# EAGLE design hackvision_v1.0 (EAGLE 5.06)
REV: 1.0
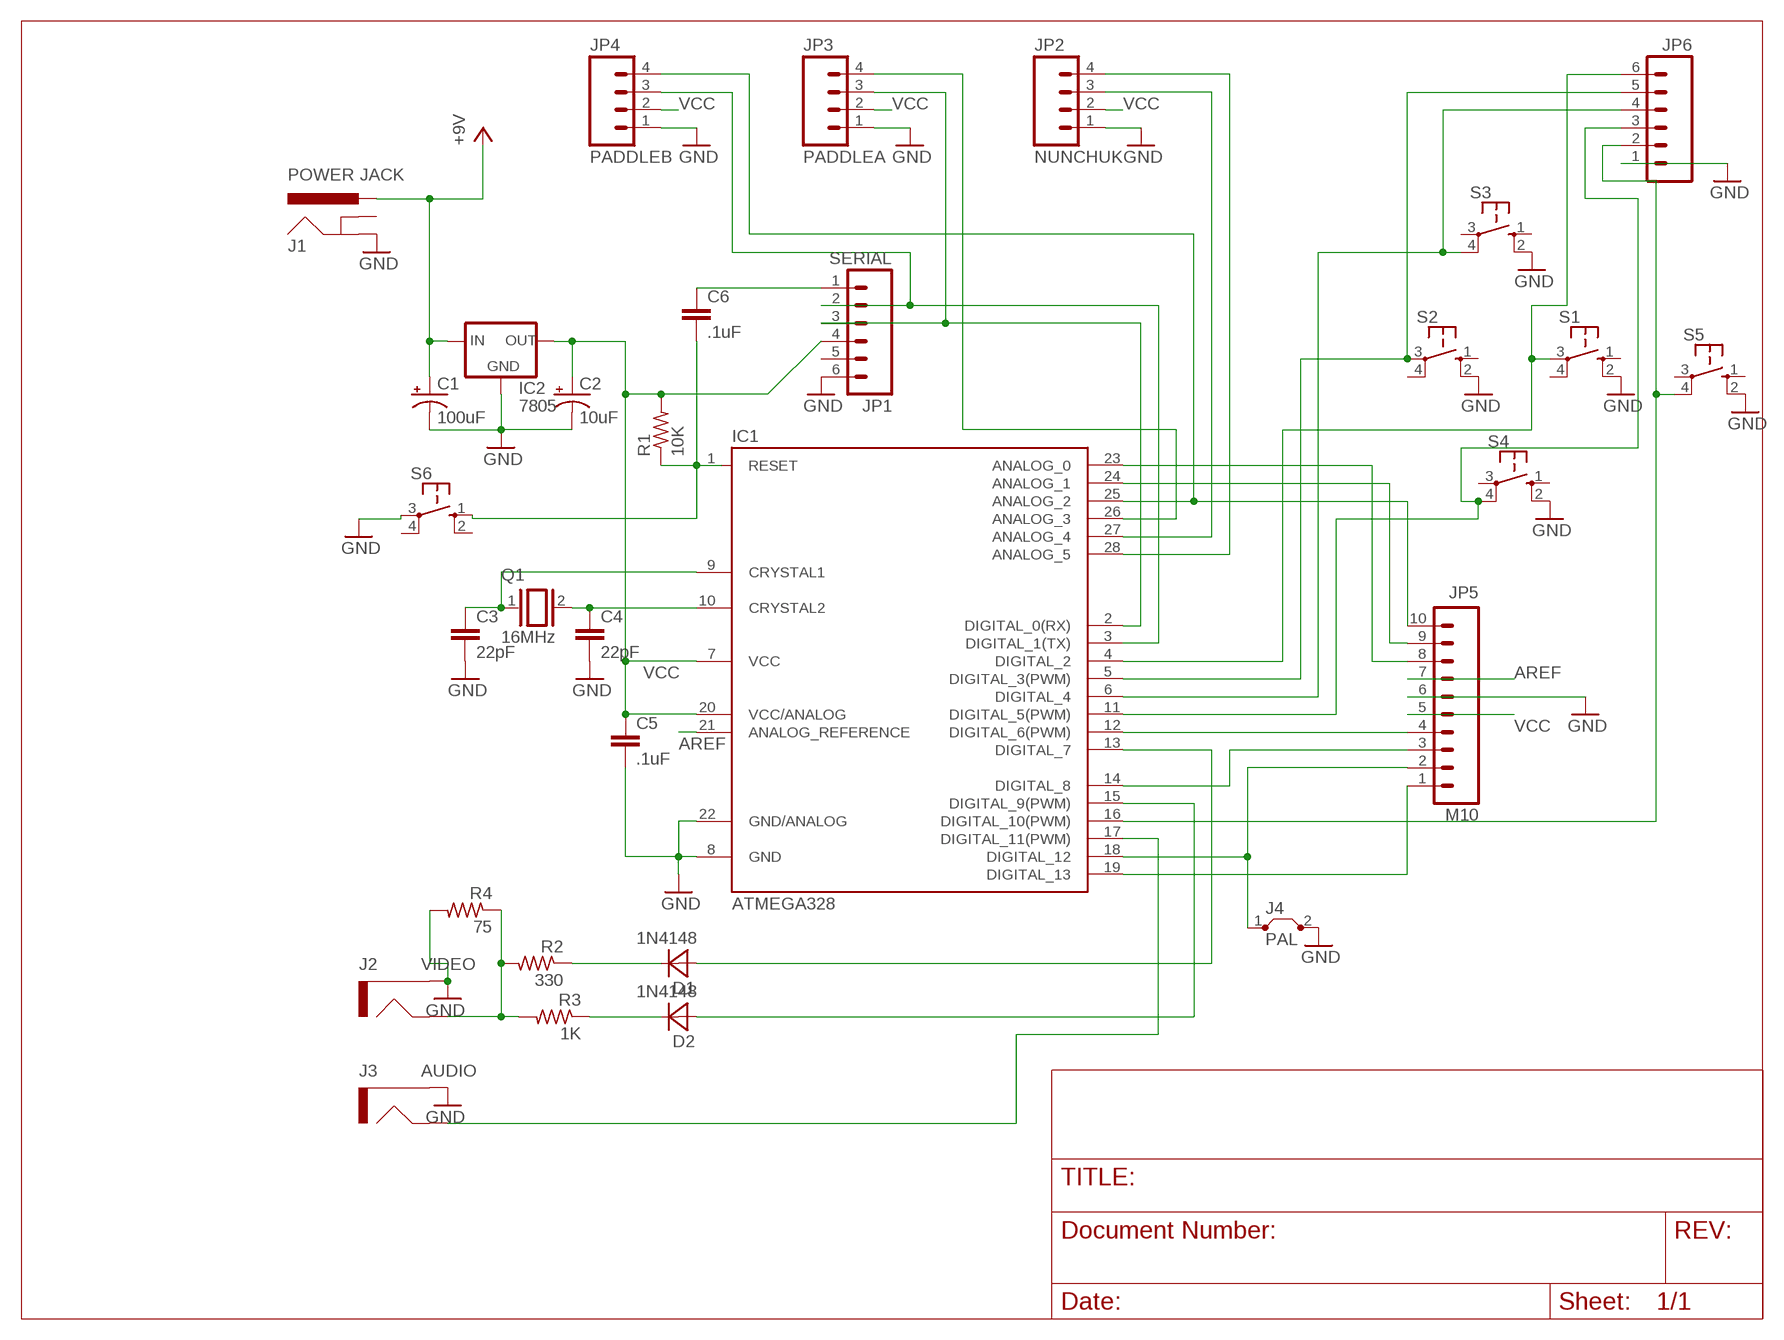
[diagram p0: schematic, sheet 1]

## Parts
C1  100uF  CAP-POL6MM  [E2.5-6]
C2  10uF  CAP-POL5MM  [E2.5-5]
C3  22pF  CAP  [CAP-CERAMIC]
C4  22pF  CAP  [CAP-CERAMIC]
C5  .1uF  CAPSMALL  [CAP-CERAMIC-SMALL]
C6  .1uF  CAPSMALL  [CAP-CERAMIC-SMALL]
D1  1N4148  [D35-10]
D2  1N4148  [D35-10]
IC1  ATMEGA328  ATMEGA168-PU  [DIL28-3]
IC2  7805  78LXX  [78LXX]
J1  POWER JACK  POWER_JACKPTH  [POWER_JACK_PTH]
J2  VIDEO  RCAJACK  [RCA]
J3  AUDIO  RCAJACK  [RCA]
J4  PAL  JUMPER  [JUMPER]
JP1  SERIAL  M06  [1X06]
JP2  NUNCHUK  M04  [1X04]
JP3  PADDLEA  M04  [1X04]
JP4  PADDLEB  M04  [1X04]
JP5  M10  [1X10]
JP6  M06  [1X06]
Q1  16MHz  XTAL/S  [QS]
R1  10K  R-US  [0207/10]
R2  330  R-US  [0207/10]
R3  1K  R-US  [0207/10]
R4  75  R-US  [0207/10]
S1  SWITCH-TACT-12MMDIAG  [SWITCH-12MM-DIAG]
S2  SWITCH-TACT-12MMDIAG  [SWITCH-12MM-DIAG]
S3  SWITCH-TACT-12MMDIAG  [SWITCH-12MM-DIAG]
S4  SWITCH-TACT-12MMDIAG  [SWITCH-12MM-DIAG]
S5  SWITCH-TACT12MM  [SWITCH-12MM]
S6  SWITCH-TACT  [SWITCH-TACT]

## Nets
A0: IC1.23(ANALOG_0) JP5.8
A1: IC1.24(ANALOG_1) JP5.9
A2: IC1.25(ANALOG_2) JP4.4 JP5.10
A3: IC1.26(ANALOG_3) JP3.4
A4: IC1.27(ANALOG_4) JP2.3
A5: IC1.28(ANALOG_5) JP2.4
AREF: IC1.21(ANALOG_REFERENCE) JP5.7
D0: IC1.2(DIGITAL_0(RX)) JP1.3 JP3.3
D1: IC1.3(DIGITAL_1(TX)) JP1.2 JP4.3
D2: IC1.4(DIGITAL_2) JP6.6 S1.3(P)
D3: IC1.5(DIGITAL_3(PWM)) JP6.5 S2.3(P)
D4: IC1.6(DIGITAL_4) JP6.4 S3.4(P1)
D5: IC1.11(DIGITAL_5(PWM)) JP6.3 S4.4(P1)
D6: IC1.12(DIGITAL_6(PWM)) JP5.4
D7: D1.A IC1.13(DIGITAL_7)
D8: IC1.14(DIGITAL_8) JP5.3
D9: D2.A IC1.15(DIGITAL_9(PWM))
D10: IC1.16(DIGITAL_10(PWM)) JP6.2 S5.4(P1)
D11: IC1.17(DIGITAL_11(PWM)) J3.P$2(SIGNAL)
D12: IC1.18(DIGITAL_12) J4.1 JP5.2
D13: IC1.19(DIGITAL_13) JP5.1
GND: C1.- C2.- C3.2 C4.2 C5.2 IC1.8(GND) IC1.22(GND/ANALOG) IC2.GND J1.GND J2.BARREL(GND) J3.BARREL(GND) J4.2 JP1.6 JP2.1 JP3.1 JP4.1 JP5.6 JP6.1 R4.2 S1.2(S1) S2.2(S1) S3.2(S1) S4.2(S1) S5.2(S1) S6.3(P)
N$1: J2.P$2(SIGNAL) R2.2 R3.2 R4.1
N$3: D1.C R2.1
N$4: C4.1 IC1.10(CRYSTAL2) Q1.2
N$5: D2.C R3.1
N$6: C3.1 IC1.9(CRYSTAL1) Q1.1
N$7: C6.2 IC1.1(RESET) R1.1 S6.1(S)
N$9: C6.1 JP1.1
VCC: C2.+ C5.1 IC1.7(VCC) IC1.20(VCC/ANALOG) IC2.OUT JP1.4 JP2.2 JP3.2 JP4.2 JP5.5 R1.2
VIN: C1.+ IC2.IN J1.PWR ; supply symbol labelled +9V
Unconnected: J1.GNDBREAK JP1.5 S1.1(S) S1.4(P1) S2.1(S) S2.4(P1) S3.1(S) S3.3(P) S4.1(S) S4.3(P) S5.1(S) S5.3(P) S6.2(S1) S6.4(P1)

## Library data of the parts
C1 C2 = nootropicdesign:CAP-POL: Capacitor - Polarized, Electrolytic
C3-C6 = nootropicdesign:CAP: Unpolarized capacitor
D1 D2 = nootropicdesign:1N4148
IC1 = Arduino-AVR:ATMEGA168-PU
IC2 = v-reg:78LXX: VOLTAGE REGULATOR
J1 = SparkFun:POWER_JACK: Power Jack This is the standard 5.5mm barrel jack for power. The PTH is the most common, proven, reliable, footprint. All others are experimental. The Slot footprint only works if the mill layer is transmitted to the PCB fab house so be warned. Spark Fun Electronics SKU : PRT-00119. Mating wall wart : TOL-00298 (and others)
J2 J3 = nootropicdesign:RCAJACK: RCA jack
J4 = nootropicdesign:JUMPER
JP1 JP6 = nootropicdesign:M06: 6-pin header
JP2-JP4 = nootropicdesign:M04: 4-pin header
JP5 = nootropicdesign:M10: 10-pin header
Q1 = special:XTAL/S: CRYSTAL
R1-R4 = nootropicdesign:R-US: Resistor
S1-S4 = nootropicdesign:SWITCH-TACT-12MM: 12MM Tactile Switch
S5 S6 = nootropicdesign:SWITCH-TACT: 12MM Tactile Switch

## Board
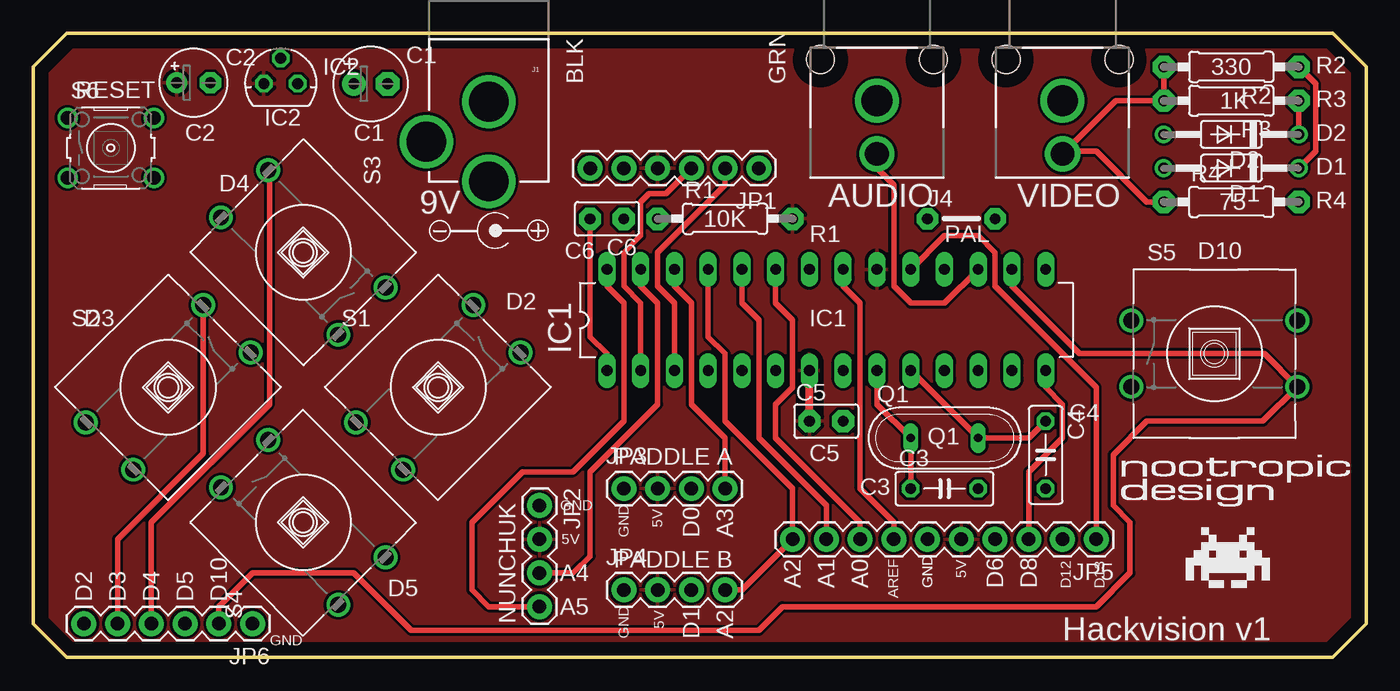
[diagram p1: board, top side]
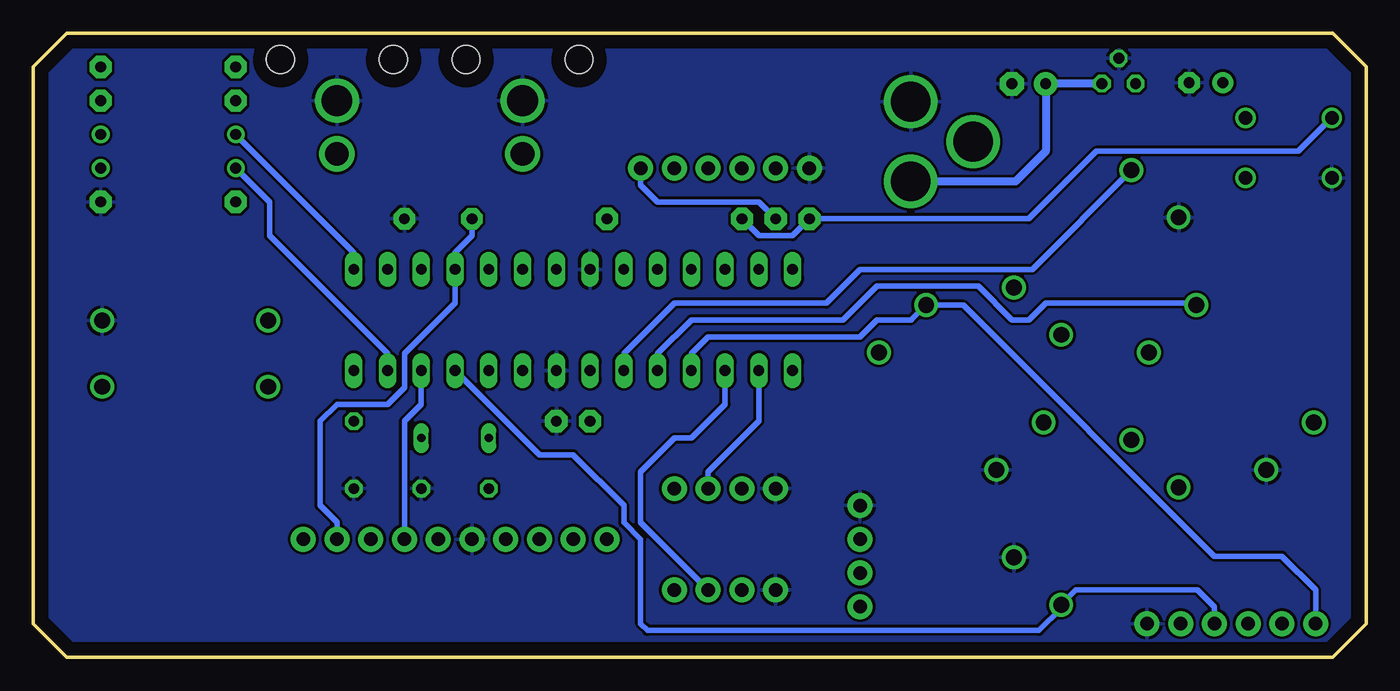
[diagram p2: board, bottom side, seen from below]

Size 100.33 x 46.99 mm. Coordinates in mm from the lower left corner, seen from the top.
Outline: 0,44.45 2.54,46.99 97.79,46.99 100.33,44.45 100.33,2.54 97.79,0 2.54,0 0,2.54 0,44.45
Copper layers (1*16): Top 0.035mm / dielectric 1.5mm / Bottom 0.035mm
Design rules "default": minimum track width 10mil, minimum drill 24mil, track to track 8mil, track to pad 8mil, pad to pad 8mil, via to via 8mil, smd to smd 8mil, copper to edge 40mil, drill to drill 8mil, minimum pad ring 10mil, minimum via ring 8mil, stop-mask expansion 4mil, vias tented up to drill 0mil, thermal gap 10mil
tRestrict: area 58.7,18.6 to 59.5,20.3; area 57.4,18.6 to 58.1,20.3; area 59.3,18.1 to 59.5,18.6; area 57.4,18.1 to 57.6,18.6; 2 lines

### Footprints (pad centres in the part's own frame; a part is rotated, then mirrored left to right if it is on the bottom)
E2.5-6 = drill 0.813 pad 1.778 round: + -1.27,0 | drill 0.813 pad 1.778 octagon: - 1.27,0
E2.5-5 = drill 0.813 pad 1.6 round: + -1.27,0 | drill 0.813 pad 1.6 octagon: - 1.27,0
CAP-CERAMIC = drill 0.813 octagon: 1 -2.54,0; 2 2.54,0
CAP-CERAMIC-SMALL = drill 0.813 pad 1.676 octagon: 1 -1.27,0; 2 1.27,0
D35-10 = drill 0.813 round: A 5.08,0; C -5.08,0
DIL28-3 = drill 0.813 long: 1 -16.51,-3.81; 2 -13.97,-3.81; 3 -11.43,-3.81; 4 -8.89,-3.81; 5 -6.35,-3.81; 6 -3.81,-3.81; 7 -1.27,-3.81; 8 1.27,-3.81; 9 3.81,-3.81; 10 6.35,-3.81; 11 8.89,-3.81; 12 11.43,-3.81; 13 13.97,-3.81; 14 16.51,-3.81; 15 16.51,3.81; 16 13.97,3.81; 17 11.43,3.81; 18 8.89,3.81; 19 6.35,3.81; 20 3.81,3.81; 21 1.27,3.81; 22 -1.27,3.81; 23 -3.81,3.81; 24 -6.35,3.81; 25 -8.89,3.81; 26 -11.43,3.81; 27 -13.97,3.81; 28 -16.51,3.81
78LXX = drill 0.813 octagon: GND 0,1.905; IN 1.27,0; OUT -1.27,0
POWER_JACK_PTH = drill 2.997 round: GND 0,7.7; GNDBREAK 4.7,10.7; PWR 0,13.7
RCA = drill 2.3 round: BARREL 0,0 | drill 1.778 pad 2.54 round: P$2 4.02,0.002 | hole 2.1: -3.1,4.25; -3.1,-4.25
JUMPER = drill 0.813 pad 1.6 octagon: 1 -2.54,0; 2 2.54,0
1X06 = drill 1.016 pad 1.88 round: 1 0,0; 2 2.54,0; 3 5.08,0; 4 7.62,0; 5 10.16,0; 6 12.7,0
1X04 = drill 1.016 pad 1.88 round: 1 -3.81,0; 2 -1.27,0; 3 1.27,0; 4 3.81,0
1X10 = drill 1.016 pad 1.88 round: 1 -11.43,0; 2 -8.89,0; 3 -6.35,0; 4 -3.81,0; 5 -1.27,0; 6 1.27,0; 7 3.81,0; 8 6.35,0; 9 8.89,0; 10 11.43,0
QS = drill 0.61 long: 1 -2.54,0; 2 2.54,0
0207/10 = drill 0.813 pad 1.676 octagon: 1 -5.08,0; 2 5.08,0
SWITCH-12MM-DIAG = drill 1.194 round: 1 -6.198,-2.642; 2 2.642,6.198; 3 -2.642,-6.198; 4 6.198,2.642
SWITCH-12MM = drill 1.194 round: 1 -6.248,2.489; 2 6.248,2.489; 3 -6.248,-2.489; 4 6.248,-2.489
SWITCH-TACT = drill 1.016 round: 1 -3.251,2.261; 2 3.251,2.261; 3 -3.251,-2.261; 4 3.251,-2.261

### Placement (x,y rotation side)
C1  25.4,43.18 0 top
C2  12.06,43.26 0 top
C3  68.58,12.7 0 top
C4  76.2,15.24 270 top
C5  59.69,17.78 0 top
C6  43.18,33.02 180 top
D1  90.17,36.83 180 top
D2  90.17,39.37 180 top
IC1  59.69,25.4 0 top
IC2  18.63,43.2 0 top
J1  34.29,49.53 180 top
J2  77.47,41.91 270 top
J3  63.5,41.91 270 top
J4  69.85,33.02 0 top
JP1  54.61,36.83 180 top
JP2  38.1,7.62 270 top
JP3  48.26,12.7 0 top
JP4  48.26,5.08 0 top
JP5  68.58,8.89 180 top
JP6  16.51,2.54 180 top
Q1  68.58,16.51 0 top
R1  52.07,33.02 0 top
R2  90.17,44.45 180 top
R3  90.17,41.91 180 top
R4  90.17,34.29 0 top
S1  30.48,20.32 180 top
S2  10.16,20.32 180 top
S3  20.32,30.48 90 top
S4  20.32,10.16 270 top
S5  88.9,22.86 0 top
S6  5.84,38.35 0 top

### Tracks (layer width: path | path; a pad name or v marks a point on that pad's centre or on a via)
A0
  Top 0.406: IC1.23 55.88,26.67 57.15,25.4 57.15,20.32 55.88,19.05 55.88,16.51 62.23,10.16 JP5.8
A1
  Top 0.406: IC1.24 53.34,26.67 54.61,25.4 54.61,16.51 59.69,11.43 JP5.9
A2
  Top 0.406: IC1.25 50.8,24.13 52.07,22.86 52.07,17.78 57.15,12.7 JP5.10 53.34,5.08 JP4.4
A3
  Top 0.406: JP3.4 52.07,16.51 49.53,19.05 49.53,26.67 48.26,27.94 IC1.26
A4
  Top 0.406: IC1.27 45.72,27.94 46.99,26.67 46.99,19.05 41.91,13.97 41.91,7.62 40.64,6.35 JP2.3
A5
  Top 0.406: IC1.28 43.18,27.94 44.45,26.67 44.45,17.78 40.64,13.97 36.83,13.97 33.02,10.16 33.02,5.08 34.29,3.81 JP2.4
AREF
  Top 0.406: IC1.21 60.96,27.94 62.23,26.67 62.23,12.7 64.77,10.16 JP5.7
D0
  Top 0.406: IC1.2 45.72,26.67 44.45,27.94 44.45,30.48 45.72,31.75 45.72,34.29 46.35,34.92 47.62,34.92 JP1.3
  Bottom 0.406: IC1.2 45.72,17.78 49.53,13.97 JP3.3
D1
  Top 0.406: IC1.3 48.26,26.67 46.99,27.94 46.99,30.48 52.07,35.56 JP1.2
  Bottom 0.406: IC1.3 48.26,19.05 50.8,16.51 52.07,16.51 54.61,13.97 54.61,10.16 JP4.3
D2
  Bottom 0.406: IC1.4 50.8,22.86 49.53,24.13 38.1,24.13 36.83,25.4 34.29,25.4 | 34.29,25.4 34.24,25.4 | 34.29,25.4 33.17,26.52 S1.3 30.33,26.52 11.43,7.62 6.35,7.62 3.81,5.08 JP6.6
D3
  Top 0.406: S2.3 12.8,15.34 6.35,8.89 JP6.5
  Bottom 0.406: IC1.5 53.34,22.86 50.8,25.4 39.37,25.4 36.83,27.94 29.21,27.94 26.67,25.4 25.4,25.4 24.13,26.67 12.95,26.67 S2.3
D4
  Top 0.406: S3.4 17.78,36.58 17.78,19.05 8.89,10.16 JP6.4
  Bottom 0.406: IC1.6 55.88,22.86 52.07,26.67 40.64,26.67 38.1,29.21 25.15,29.21 S3.4
D5
  Bottom 0.406: IC1.11 62.23,15.24 59.69,15.24 55.88,11.43 55.88,10.16 54.61,8.89 54.61,2.54 54.1,2.03 24.64,2.03 22.96,3.71 S4.4 21.84,5.08 12.7,5.08 11.43,3.81 JP6.3
D6
  Bottom 0.406: IC1.12 71.12,19.05 72.39,17.78 JP5.4
D7
  Bottom 0.406: IC1.13 73.66,22.86 82.55,31.75 82.55,34.29 D1.A
D8
  Top 0.406: IC1.14 76.2,20.32 77.47,19.05 77.47,16.51 74.93,13.97 JP5.3
D9
  Bottom 0.406: IC1.15 76.2,30.48 D2.A
D10
  Top 0.406: IC1.16 73.66,27.94 78.74,22.86 92.66,22.86 S5.4 92.56,17.78 83.82,17.78 81.28,15.24 81.28,11.43 82.55,10.16 82.55,6.35 80.01,3.81 56.39,3.81 54.61,2.03 28.45,2.03 24.13,6.35 16.51,6.35 13.97,3.81 JP6.2
D11
  Top 0.406: IC1.17 68.58,26.67 66.04,26.67 64.77,27.94 64.77,35.56 63.5,36.83 J3.P$2
D12
  Bottom 0.406: JP5.2 77.47,10.16 78.74,11.43 78.74,17.78 77.47,19.05 73.66,19.05 72.39,20.32 72.39,22.86 68.58,26.67 IC1.18 68.58,30.48 67.31,31.75 J4.1
D13
  Top 0.406: IC1.19 68.58,31.75 71.12,31.75 72.39,30.48 72.39,27.94 80.01,20.32 JP5.1
GND
  pour Bottom: 2.67,46.61 97.66,46.61 99.95,44.32 99.95,2.67 97.66,0.38 2.67,0.38 0.38,2.67 0.38,44.32
N$1
  Top 0.406: R2.2 R3.2 81.49,41.91 J2.P$2 77.68,38.1 80.01,38.1 83.82,34.29 R4.1
N$3
  Top 0.406: R2.1 96.52,43.18 96.52,38.1 D1.C
N$4
  Top 0.406: IC1.10 Q1.2 74.93,16.51 C4.1
N$5
  Top 0.406: D2.C R3.1
N$6
  Top 0.406: IC1.9 63.5,19.05 Q1.1 C3.1
N$7
  Top 0.406: IC1.1 43.18,22.86 41.91,24.13 C6.2
  Bottom 0.406: R1.1 45.72,31.75 43.18,31.75 C6.2 25.4,33.02 20.32,38.1 5.11,38.1 S6.1
N$9
  Bottom 0.406: JP1.1 54.61,35.56 53.34,34.29 45.72,34.29 C6.1
VCC
  Top 0.61: C5.1 IC1.7
  pour Top: 0.38,44.32 2.67,46.61 97.66,46.61 99.95,44.32 99.95,2.67 97.66,0.38 2.79,0.38 2.67,0.38 0.38,2.67
VIN
  Bottom 0.61: J1.PWR 26.4,35.83 24.13,38.1 C1.+ 19.92,43.18 IC2.IN

### Text on the board
tPlace: 330 | R2 | BLK | GRN | RESET | 1K | R3 | IC2 | C2 | C1 | D2 | D1 | D4 | AUDIO | VIDEO | 75 | R4 | 9V | 10K | R1 | PAL | C6 | D10 | D2 | D3 | IC1 | C4 | Q1 | C5 | PADDLE A | C3 | GND | 5V | 5V | GND | D0 | A3 | PADDLE B | A4 | 5V | D5 | A2 | A1 | A0 | GND | GND | D6 | D8 | D12 | D13 | D2 | D3 | D4 | D5 | D10 | AREF | NUNCHUK | A5 | 5V | GND | GND | D1 | A2 | Hackvision v1